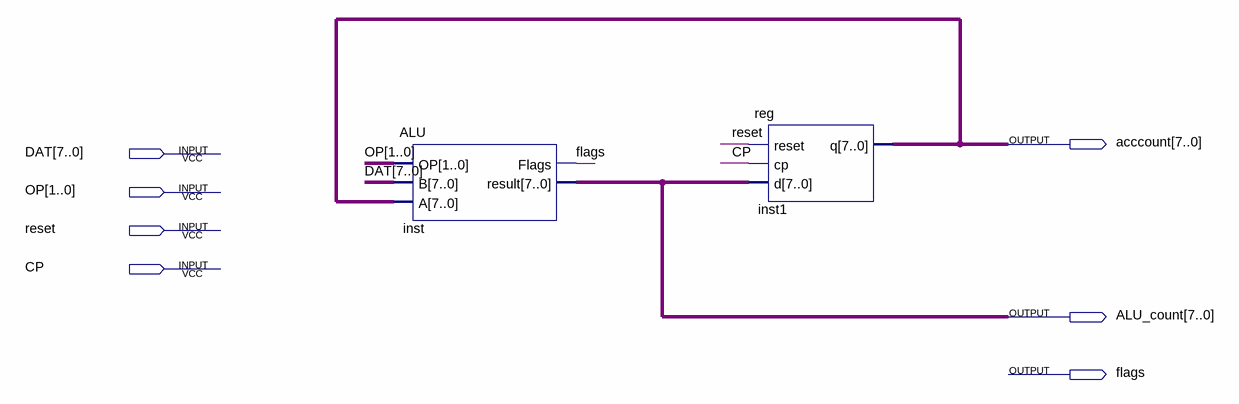
[diagram p0: schematic sheet]
// Quartus schematic YSQ.bdf as structural Verilog: 2 symbols, 7 pins
module YSQ (
  input  [7:0] DAT,
  input  [1:0] OP,
  input  reset,
  input  CP,
  output [7:0] acccount,
  output [7:0] ALU_count,
  output flags
);

  ALU inst (.OP(OP), .B(DAT), .A(acccount), .Flags(flags), .result(ALU_count));
  \reg  inst1 (.reset(reset), .cp(CP), .d(ALU_count), .q(acccount));
endmodule
